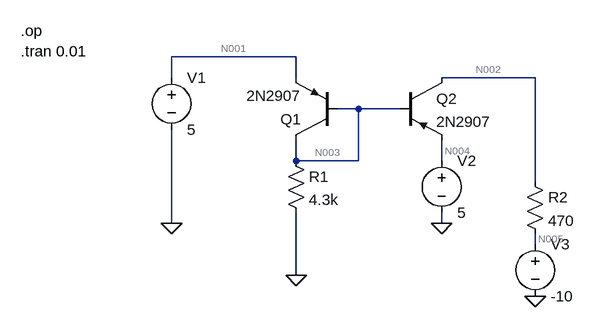
[diagram p0: schematic Current Mirror.asc]
Current Mirror.asc, the LTspice schematic file:
Version 4
SHEET 1 880 680
WIRE 336 160 144 160
WIRE 144 192 144 160
WIRE 336 192 336 160
WIRE 704 192 560 192
WIRE 432 240 400 240
WIRE 496 240 432 240
WIRE 336 320 336 288
WIRE 432 320 432 240
WIRE 432 320 336 320
WIRE 560 320 560 288
WIRE 704 352 704 192
WIRE 144 416 144 272
WIRE 560 416 560 400
WIRE 704 448 704 432
WIRE 336 496 336 400
FLAG 144 416 0
FLAG 560 416 0
FLAG 704 528 0
FLAG 336 496 0
SYMBOL voltage 144 176 R0
SYMATTR InstName V1
SYMATTR Value 5
SYMBOL voltage 560 304 R0
SYMATTR InstName V2
SYMATTR Value 5
SYMBOL pnp 400 288 R180
SYMATTR InstName Q1
SYMATTR Value 2N2907
SYMBOL pnp 496 192 R0
SYMATTR InstName Q2
SYMATTR Value 2N2907
SYMBOL res 320 304 R0
SYMATTR InstName R1
SYMATTR Value 4.3k
SYMBOL res 688 336 R0
SYMATTR InstName R2
SYMATTR Value 470
SYMBOL voltage 704 432 R0
SYMATTR InstName V3
SYMATTR Value -10
TEXT -88 120 Left 2 !.op\n.tran 0.01

The netlist it stands for:
* Current Mirror.asc
V1 N001 0 5
V2 N004 0 5
Q1 N003 N003 N001 0 2N2907
Q2 N002 N003 N004 0 2N2907
R1 N003 0 4.3k
R2 N002 N005 470
V3 N005 0 -10
.model NPN NPN
.model PNP PNP
.lib standard.bjt
.op
.tran 0.01
.backanno
.end

* Results of the author's LTspice run, read from the files saved beside the schematic
* Operating Point, zero values left out:
*   V(n001) = 5 V
*   V(n004) = 5 V
*   V(n003) = 4.344 V
*   V(n002) = -9.475 V
*   V(n005) = -10 V
*   Ic(Q2) = -1.117 mA
*   Ib(Q2) = -4.019 µA
*   Ie(Q2) = 1.121 mA
*   Ic(Q1) = -1.002 mA
*   Ib(Q1) = -4.023 µA
*   Ie(Q1) = 1.006 mA
*   I(R2) = 1.117 mA
*   I(R1) = 1.01 mA
*   I(V3) = 1.117 mA
*   I(V2) = -1.121 mA
*   I(V1) = -1.006 mA